# EAGLE schematic SparkFun_GPS_ZED-F9K (EAGLE 9.5.2)
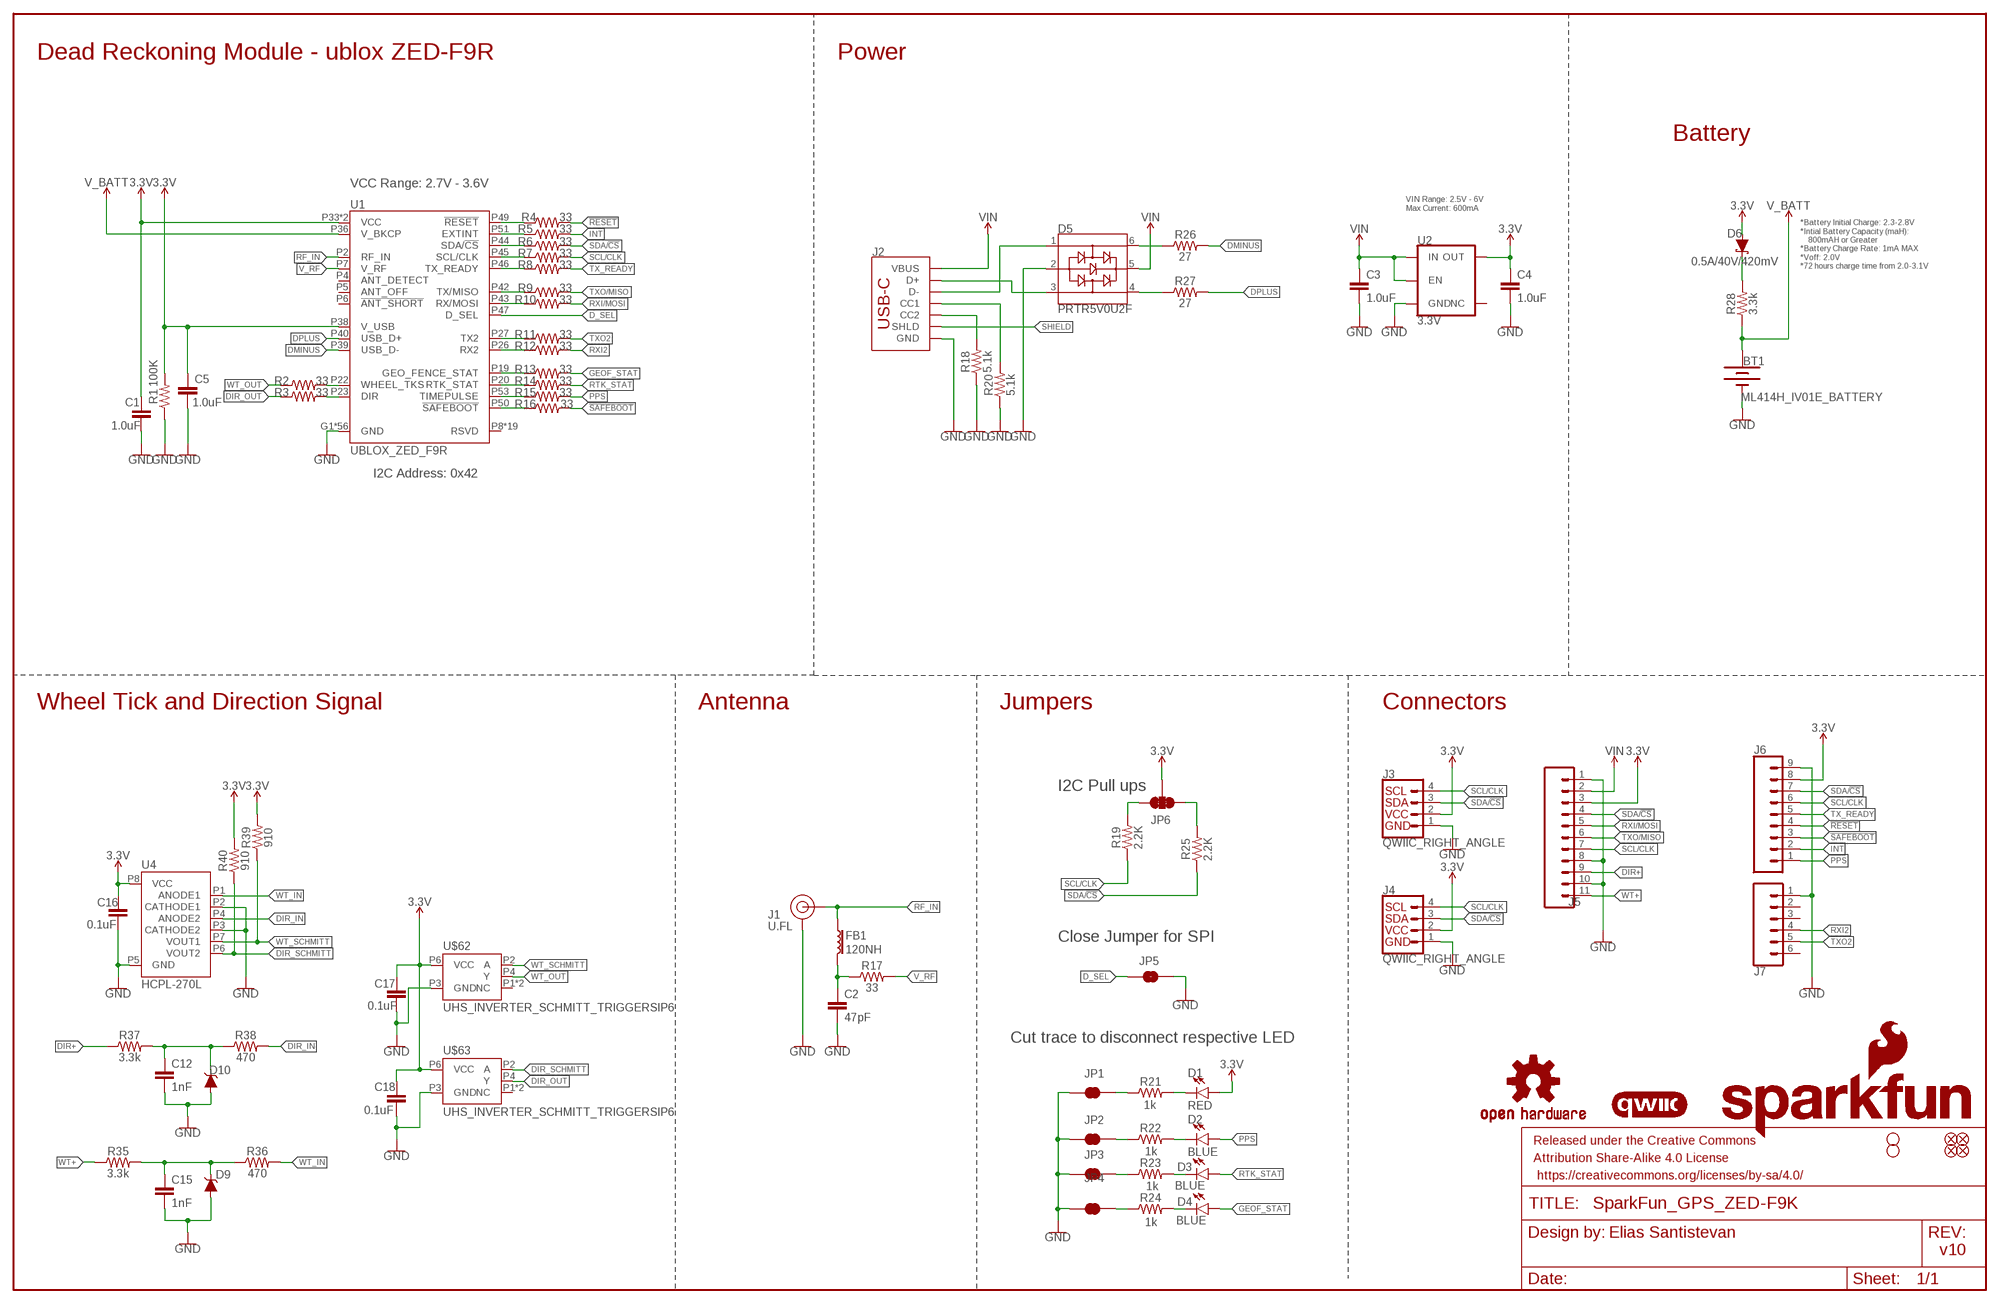
[diagram p0: schematic, sheet 1]

## Parts
$1_36_$_2020-02-13_17-32-45  STAND-OFFTIGHT  [STAND-OFF-TIGHT]
BT1  ML414H_IV01E_BATTERY  [ML414H_IV01E]
C1  1.0uF  1.0UF-0603-16V-10%-X7R  [0603]
C2  47pF  47PF-0402-25V-5%-X7R  [0402]
C3  1.0uF  1.0UF-0603-16V-10%-X7R  [0603]
C4  1.0uF  1.0UF-0603-16V-10%-X7R  [0603]
C5  1.0uF  1.0UF-0603-16V-10%-X7R  [0603]
C12  1nF  1.0NF/1000PF-0402-25V-10%-X7R  [0402]
C15  1nF  1.0NF/1000PF-0402-25V-10%-X7R  [0402]
C16  0.1uF  0.1UF-0402-6.3V-10%-X7R  [0402]
C17  0.1uF  0.1UF-0402-6.3V-10%-X7R  [0402]
C18  0.1uF  0.1UF-0402-6.3V-10%-X7R  [0402]
D1  RED  LED-RED0603  [LED-0603]
D2  BLUE  LED-BLUE0603  [LED-0603]
D3  BLUE  LED-BLUE0603  [LED-0603]
D4  BLUE  LED-BLUE0603  [LED-0603]
D5  PRTR5V0U2F  [SOT886]
D6  0.5A/40V/420mV  DIODE-SCHOTTKY-PMEG4005EJ  [SOD-323]
D9  0.5A/40V/420mV  BZX84_DIODE  [SOT23_BZX]
D10  0.5A/40V/420mV  BZX84_DIODE  [SOT23_BZX]
FB1  120NH  FERRITE_BEAD_GNSS  [0402_MURATA]
FD1  FIDUCIALUFIDUCIAL  [FIDUCIAL-MICRO]
FD2  FIDUCIALUFIDUCIAL  [FIDUCIAL-MICRO]
FD3  FIDUCIALUFIDUCIAL  [FIDUCIAL-MICRO]
FD4  FIDUCIALUFIDUCIAL  [FIDUCIAL-MICRO]
FRAME1  FRAME-LEDGER  [CREATIVE_COMMONS]
H2  STAND-OFFTIGHT  [STAND-OFF-TIGHT]
J1  U.FL  U.FL2PIN  [U.FL]
J2  USB_C_2-LAYER_PADS  [USB-C-16P-2LAYER-PADS]
J3  QWIIC_RIGHT_ANGLE  QWIIC_CONNECTORJS-1MM  [JST04_1MM_RA]
J4  QWIIC_RIGHT_ANGLE  QWIIC_CONNECTORJS-1MM  [JST04_1MM_RA]
J5  CONN_111X11_NO_SILK  [1X11_NO_SILK]
J6  CONN_09NO_SILK  [1X09_NO_SILK]
J7  CONN_06NO_SILK_NO_POP  [1X06_NO_SILK]
JP1  JUMPER-SMT_2_NC_TRACE_SILK  [SMT-JUMPER_2_NC_TRACE_SILK]
JP2  JUMPER-SMT_2_NC_TRACE_SILK  [SMT-JUMPER_2_NC_TRACE_SILK]
JP3  JUMPER-SMT_2_NC_TRACE_SILK  [SMT-JUMPER_2_NC_TRACE_SILK]
JP4  JUMPER-SMT_2_NC_TRACE_SILK  [SMT-JUMPER_2_NC_TRACE_SILK]
JP5  JUMPER-SMT_2_NO_SILK  [SMT-JUMPER_2_NO_SILK]
JP6  JUMPER-SMT_3_2-NC_TRACE_SILK  [SMT-JUMPER_3_2-NC_TRACE_SILK]
LOGO1  OSHW-LOGOM  [OSHW-LOGO-M]
LOGO2  QWIIC_LOGO_4MM  [QWIIC_4MM]
LOGO3  SFE_LOGO_NAME_FLAME.2_INCH  [SFE_LOGO_NAME_FLAME_.2]
R1  100K  100KOHM-0402-1/16W-1%  [0402]
R2  33  33OHM-0402-1/10W-1%  [0402]
R3  33  33OHM-0402-1/10W-1%  [0402]
R4  33  33OHM-0402-1/10W-1%  [0402]
R5  33  33OHM-0402-1/10W-1%  [0402]
R6  33  33OHM-0402-1/10W-1%  [0402]
R7  33  33OHM-0402-1/10W-1%  [0402]
R8  33  33OHM-0402-1/10W-1%  [0402]
R9  33  33OHM-0402-1/10W-1%  [0402]
R10  33  33OHM-0402-1/10W-1%  [0402]
R11  33  33OHM-0402-1/10W-1%  [0402]
R12  33  33OHM-0402-1/10W-1%  [0402]
R13  33  33OHM-0402-1/10W-1%  [0402]
R14  33  33OHM-0402-1/10W-1%  [0402]
R15  33  33OHM-0402-1/10W-1%  [0402]
R16  33  33OHM-0402-1/10W-1%  [0402]
R17  33  33OHM-0603-1/10W-1%  [0603]
R18  5.1k  5.1KOHM-0402-1/16W-1%  [0402]
R19  2.2K  2.2KOHM-0402-1/16W-1%  [0402]
R20  5.1k  5.1KOHM-0402-1/16W-1%  [0402]
R21  1KOHM-0402-1/16W-1%  [0402]
R22  1KOHM-0402-1/16W-1%  [0402]
R23  1KOHM-0402-1/16W-1%  [0402]
R24  1KOHM-0402-1/16W-1%  [0402]
R25  2.2K  2.2KOHM-0402-1/16W-1%  [0402]
R26  27  27OHM-0603-1/10W-1%  [0603]
R27  27  27OHM-0603-1/10W-1%  [0603]
R28  3.3k  3.3KOHM-0603-1/10W-1%  [0603]
R35  3.3k  3.3KOHM-0603-1/10W-1%  [0603]
R36  470  470OHM-0603-1/10W-1%  [0603]
R37  3.3k  3.3KOHM-0603-1/10W-1%  [0603]
R38  470  470OHM-0603-1/10W-1%  [0603]
R39  910  910OHM-0603-1/10W-5%  [0603]
R40  910  910OHM-0603-1/10W-5%  [0603]
U1  UBLOX_ZED_F9R  [UBLOX_ZED_F9R]
U2  3.3V  V_REG_AP2112K-3.3V  [SOT23-5]
U4  HCPL-270L  [SOP_8-PIN]
U$62  UHS_INVERTER_SCHMITT_TRIGGERSIP6  [SIP6]
U$63  UHS_INVERTER_SCHMITT_TRIGGERSIP6  [SIP6]

## Nets
3.3V: C1.1 C4.1 C5.1 C16.1 C17.1 C18.1 D1.A D6.A J3.2 J4.2 J5.3 J6.8 JP6.2 R1.2 R39.2 R40.2 U1.P33(VCC) U1.P34(VCC) U1.P38(V_USB) U2.5(OUT) U4.P8(VCC) U$62.P6(VCC) U$63.P6(VCC)
!RESET: J6.4 R4.2
!SAFEBOOT: J6.3 R16.2
D_SEL: JP5.1 U1.P47(D_SEL)
DIR+: J5.9 R37.1
DIR_IN: R38.2 U4.P4(ANODE2)
DIR_OUT: R3.1 U$63.P4(Y)
DIR_SCHMITT: R40.1 U4.P6(VOUT2) U$63.P2(A)
DMINUS: R26.2 U1.P39(USB_D-)
DPLUS: R27.2 U1.P40(USB_D+)
GEOF_STAT: D4.A R13.2
GND: BT1.- C1.2 C2.2 C3.2 C4.2 C5.2 C12.2 C15.2 C16.2 C17.2 C18.2 D5.2 D9.P1(A) D10.P1(A) J1.1(GND) J1.2(GND) J2.GND J2.GND2(GND) J3.1 J4.1 J5.1 J5.8 J5.10 J6.9 J7.1 JP1.1 JP2.1 JP3.1 JP4.1 JP5.2 R1.1 R18.1 R20.1 U1.G1(GND) U1.G2(GND) U1.G3(GND) U1.G4(GND) U1.G5(GND) U1.G6(GND) U1.G7(GND) U1.G8(GND) U1.G9(GND) U1.G10(GND) U1.G11(GND) U1.G12(GND) U1.G13(GND) U1.G14(GND) U1.G15(GND) U1.G16(GND) U1.G17(GND) U1.G18(GND) U1.G19(GND) U1.G20(GND) U1.G21(GND) U1.G22(GND) U1.G23(GND) U1.G24(GND) U1.G25(GND) U1.G26(GND) U1.G27(GND) U1.G28(GND) U1.G29(GND) U1.G30(GND) U1.G31(GND) U1.G32(GND) U1.G33(GND) U1.G34(GND) U1.G35(GND) U1.G36(GND) U1.G37(GND) U1.G38(GND) U1.G39(GND) U1.G40(GND) U1.G41(GND) U1.G42(GND) U1.G43(GND) U1.G44(GND) U1.G45(GND) U1.G46(GND) U1.G47(GND) U1.G48(GND) U1.P1(GND) U1.P3(GND) U1.P12(GND) U1.P14(GND) U1.P32(GND) U1.P37(GND) U1.P41(GND) U1.P48(GND) U2.2(GND) U4.P2(CATHODE1) U4.P3(CATHODE2) U4.P5(GND) U$62.P3(GND) U$63.P3(GND)
INT: J6.2 R5.2
N$1: JP6.1 R25.2
N$2: D6.C R28.2
N$3: JP6.3 R19.2
N$4: D1.C R21.2
N$5: C2.1 FB1.P2 R17.1
N$6: D5.3 J2.A6(D+) J2.B6(D+)
N$7: D5.1 J2.A7(D-) J2.B7(D-)
N$8: JP1.2 R21.1
N$9: D5.6 R26.1
N$10: D5.4 R27.1
N$11: R4.1 U1.P49(!RESET!)
N$12: R5.1 U1.P51(EXTINT)
N$14: J2.B5(CC2) R18.2
N$15: J2.A5(CC1) R20.2
N$16: R6.1 U1.P44(SDA/!CS!)
N$17: R7.1 U1.P45(SCL/CLK)
N$18: R8.1 U1.P46(TX_READY)
N$19: R9.1 U1.P42(TX/MISO)
N$20: R10.1 U1.P43(RX/MOSI)
N$21: R11.1 U1.P27(TX2)
N$22: JP3.2 R23.1
N$23: JP2.2 R22.1
N$24: D2.C R22.2
N$25: D3.C R23.2
N$26: R12.1 U1.P26(RX2)
N$27: R13.1 U1.P19(GEO_FENCE_STAT)
N$28: R14.1 U1.P20(RTK_STAT)
N$29: R15.1 U1.P53(TIMEPULSE)
N$30: R16.1 U1.P50(!SAFEBOOT!)
N$31: R2.2 U1.P22(WHEEL_TKS)
N$32: R3.2 U1.P23(DIR)
N$33: JP4.2 R24.1
N$34: D4.C R24.2
N$35: C15.1 D9.P3(C) R35.2 R36.1
N$37: C12.1 D10.P3(C) R37.2 R38.1
PPS: D2.A J6.1 R15.2
RF_IN [Antenna]: FB1.P1 J1.FEED(SIGNAL) U1.P2(RF_IN)
RTK_STAT: D3.A R14.2
RXI2: J7.4 R12.2
RXI/MOSI: J5.5 R10.2
SCL/CLK: J3.4 J4.4 J5.7 J6.6 R7.2 R19.1
SDA/!CS: J3.3 J4.3 J5.4 J6.7 R6.2 R25.1
SHIELD: J2.SHLD1(SHLD) J2.SHLD2(SHLD) J2.SHLD3(SHLD) J2.SHLD4(SHLD)
TX_READY: J6.5 R8.2
TXO2: J7.5 R11.2
TXO/MISO: J5.6 R9.2
V_BATT: BT1.+ R28.1 U1.P36(V_BKCP)
V_RF: R17.2 U1.P7(V_RF)
VIN: C3.1 D5.5 J2.VBUS1(VBUS) J2.VBUS2(VBUS) J5.2 U2.1(IN) U2.3(EN)
WT+: J5.11 R35.1
WT_IN: R36.2 U4.P1(ANODE1)
WT_OUT: R2.1 U$62.P4(Y)
WT_SCHMITT: R39.1 U4.P7(VOUT1) U$62.P2(A)
Unconnected: J7.2 J7.3 J7.6 U1.P4(ANT_DETECT) U1.P5(ANT_OFF) U1.P6(!ANT_SHORT!) U1.P8(RSVD) U1.P9(RSVD) U1.P10(RSVD) U1.P11(RSVD) U1.P13(RSVD) U1.P15(RSVD) U1.P16(RSVD) U1.P17(RSVD) U1.P18(RSVD) U1.P21(RSVD) U1.P24(RSVD) U1.P25(RSVD) U1.P28(RSVD) U1.P29(RSVD) U1.P30(RSVD) U1.P31(RSVD) U1.P35(RSVD) U1.P52(RSVD) U1.P54(RSVD) U2.4(NC) U$62.P1(NC) U$62.P5(NC) U$63.P1(NC) U$63.P5(NC)

## Notes on the sheet
- Dead Reckoning Module - ublox ZED-F9R | Power
- Battery
- VCC Range: 2.7V - 3.6V
- VIN Range: 2.5V - 6V
  Max Current: 600mA
- *Battery Initial Charge: 2.3-2.8V
  *Intial Battery Capacity (maH): 
      800mAH or Greater
  *Battery Charge Rate: 1mA MAX
  *Voff: 2.0V
  *72 hours charge time from 2.0-3.1V
- I2C Address: 0x42
- Wheel Tick and Direction Signal | Antenna | Jumpers | Connectors
- I2C Pull ups
- Close Jumper for SPI
- Cut trace to disconnect respective LED
- 1k
- 1k
- 1k
- 1k
- Elias Santistevan
- v10

## Library data of the parts
$1_36_$_2020-02-13_17-32-45 H2 = SparkFun-Hardware:STAND-OFF: Stand Off Drill holes for mechanically mounting via screws, standoffs, etc. Note: Use the keepout ring to avoid running the screw head into surrounding components. Variant Overviews STAND-OFF - Mechanical footprint for a #4 phillips button head screw. STAND-OFF-TIGHT - Mechanical footprint for a #4 phillips button head screw, Example SparkFun Products Screw - Phillips Head (1/4", 4-40, 10 pack) <https://www.sparkfun.com/products/10453> (PRT-10453) Screw - Phillips Head (1/2", 4-40, 10 pack) <https://www.sparkfun.com/products/10452> (PRT-10452) Screw - Phillips Head (3/4", 4-40, 10 pack) <https://www.sparkfun.com/products/10451> (PRT-10451) Screw - Phillips Head (1", 4-40, 10 pack) <https://www.sparkfun.com/products/10450> (PRT-10450)
BT1 = SparkFun-Batteries:ML414H_IV01E_BATTERY: SEIKO ML414H-IV01E Reflowable Lithium Battery ML414H is a rechargeable, coin type battery with features such as Pb-free reflowable (Peak temperature: 260 C) and high temperature heat resistance. Battery Characteristics: 3.1V max voltage Voff is 2V 1mAH 3k series resistor with battery 72 hour charge time from 2.0-3.1V 2.3-2.8V initial charge; PROD_ID: BATT-14267
C1 C3-C5 = SparkFun-Capacitors:1.0UF: 1µF ceramic capacitors A capacitor is a passive two-terminal electrical component used to store electrical energy temporarily in an electric field.; PROD_ID: CAP-13930
C2 = SparkFun-Capacitors:47PF: 47pF ceramic capacitors A capacitor is a passive two-terminal electrical component used to store electrical energy temporarily in an electric field.; PROD_ID: CAP-15063
C12 C15 = SparkFun-Capacitors:1.0NF/1000PF: 1nF/1,000pF ceramic capacitors A capacitor is a passive two-terminal electrical component used to store electrical energy temporarily in an electric field.; PROD_ID: CAP-15061
C16-C18 = SparkFun-Capacitors:0.1UF: 0.1µF ceramic capacitors A capacitor is a passive two-terminal electrical component used to store electrical energy temporarily in an electric field.; PROD_ID: CAP-14993
D1 = SparkFun-LED:LED-RED: Red SMD LED Used in manufacturing of most products at SparkFun Packages: 0603 - SMD 0603 package [Product Link] <http://docs.avagotech.com/docs/AV02-0551EN> 0603 SMART - SMD 0603 SMART package ( more efficient and expensive)[Product Link] <http://www.osram-os.com/Graphics/XPic2/00077099_0.pdf> 1206 - SMD1206 package [Product Link] <https://www.sparkfun.com/datasheets/DevTools/LilyPad/Q150OVS4.pdff> SparkFun Products: Pro Mini 328 -5V <https://www.sparkfun.com/products/821> RedBoard <https://www.sparkfun.com/products/12757> IOIO-OTG <https://www.sparkfun.com/products/13613>; PROD_ID: DIO-00819
D2-D4 = SparkFun-LED:LED-BLUE: Blue SMD LED Used in manufacturing of various products at SparkFun Packages: 0603 - SMD 0603 package [Product Link] <http://www.digikey.com/product-detail/en/SMLE12BC7TT86/511-1589-2-ND/1641808> 1206 - SMD1206 package [Product Link] <http://www.digikey.com/product-detail/en/lite-on-inc/LTST-C150TBKT/160-1643-1-ND/573584> SparkFun Products: ESP8266 Thing-Dev Board <https://www.sparkfun.com/products/13711> RedBoard <https://www.sparkfun.com/products/12757>; PROD_ID: DIO-08575
D5 = SparkFun-IC-Power:PRTR5V0U2: A small ESD protection device. Most commonly used on USB D+/D- signals to protect large, expensive, or especially sensitive USB enabled devices.; PROD_ID: DIO-14084
D6 = SparkFun-DiscreteSemi:DIODE-SCHOTTKY: Schottky diode A Schottky diode is a semiconductor diode which has a low forward voltage drop and a very fast switching action.; PROD_ID: DIO-10955
D9 D10 = classified:BZX84_DIODE
FB1 = SparkFun-Coils:FERRITE_BEAD_GNSS
FD1-FD4 = SparkFun-Aesthetics:FIDUCIAL: Fiducial Alignment Points Point-of-reference for pick-and-place machines and other optical instruments.
FRAME1 = SparkFun-Aesthetics:FRAME-LEDGER: Schematic Frame - Ledger Standard 11x14 US Ledger frame
J1 = SparkFun-Connectors:U.FL2PIN: SMD Antenna Connector - U.FL 2mm height, 3.0mm x 3.0mm receptacle size. SparkFun Products: SparkFun WiFi Shield - ESP8266 <https://www.sparkfun.com/products/13287> SparkFun ESP8266 Thing <https://www.sparkfun.com/products/13231> SparkFun MiniGen - Pro Mini Signal Generator Shield <https://www.sparkfun.com/products/11420>; PROD_ID: CONN-09193; SF_ID: WRL-09144
J2 = SparkFun-Connectors:USB_C: USB Type C 16Pin Connector Super Speed pins not available on the 16-pin purely SMD connector so this part is best for USB 2.0 implementations. D1 and D2 are tied together enabling D+/- no matter which way the cable is plugged into the connector. The two channel configuration pins (CC1/2) are exposed. These are normally connected to ground via 5.1k resistors but can be reconfigured for high current/high power applications.; PROD_ID: CONN-14122
J3 J4 = SparkFun-Connectors:QWIIC_CONNECTOR: SparkFun I2C Standard Qwiic Connector An SMD 1mm pitch JST connector makes it easy and quick (get it? Qwiic?) to connect I2C devices to each other. The Qwiic system <http://www.sparkfun.com/qwiic> enables fast and solderless connection between popular platforms and various sensors and actuators. We carry 200mm <https://www.sparkfun.com/products/14204>, 100mm <https://www.sparkfun.com/products/14205>, 50mm <https://www.sparkfun.com/products/14206>, and breadboard friendly <https://www.sparkfun.com/products/14207> Qwiic cables. We also offer 10 pcs strips <https://www.sparkfun.com/products/14323> the SMD connectors.; PROD_ID: CONN-13694
J5 = SparkFun-Connectors:CONN_11: Multi connection point. Often used as Generic Header-pin footprint for 0.1 inch spaced/style header connections On any of the 0.1 inch spaced packages, you can populate with these: Break Away Headers - Straight <https://www.sparkfun.com/products/116> (PRT-00116) Break Away Male Headers - Right Angle <https://www.sparkfun.com/products/553> (PRT-00553) Female Headers <https://www.sparkfun.com/products/115> (PRT-00115) Break Away Headers - Machine Pin <https://www.sparkfun.com/products/117> (PRT-00117) Break Away Female Headers - Swiss Machine Pin <https://www.sparkfun.com/products/743> (PRT-00743) For SCREWTERMINALS and SPRING TERMINALS visit here: Screw Terimnals on SparkFun.com <https://www.sparkfun.com/search/results?term=Screw+Terminals> (5mm/3.5mm/2.54mm spacing) This device is also useful as a general connection point to wire up your design to another part of your project. Our various solder wires solder well into these plated through hole pads. Hook-Up Wire - Assortment (Stranded, 22 AWG) <https://www.sparkfun.com/products/11375> (PRT-11375) Hook-Up Wire - Assortment (Solid Core, 22 AWG) <https://www.sparkfun.com/products/11367> (PRT-11367) View the entire wire category on our website here <https://www.sparkfun.com/categories/141>
J6 = SparkFun-Connectors:CONN_09: Multi connection point. Often used as Generic Header-pin footprint for 0.1 inch spaced/style header connections On any of the 0.1 inch spaced packages, you can populate with these: Break Away Headers - Straight <https://www.sparkfun.com/products/116> (PRT-00116) Break Away Male Headers - Right Angle <https://www.sparkfun.com/products/553> (PRT-00553) Female Headers <https://www.sparkfun.com/products/115> (PRT-00115) Break Away Headers - Machine Pin <https://www.sparkfun.com/products/117> (PRT-00117) Break Away Female Headers - Swiss Machine Pin <https://www.sparkfun.com/products/743> (PRT-00743) For SCREWTERMINALS and SPRING TERMINALS visit here: Screw Terimnals on SparkFun.com <https://www.sparkfun.com/search/results?term=Screw+Terminals> (5mm/3.5mm/2.54mm spacing) This device is also useful as a general connection point to wire up your design to another part of your project. Our various solder wires solder well into these plated through hole pads. Hook-Up Wire - Assortment (Stranded, 22 AWG) <https://www.sparkfun.com/products/11375> (PRT-11375) Hook-Up Wire - Assortment (Solid Core, 22 AWG) <https://www.sparkfun.com/products/11367> (PRT-11367) View the entire wire category on our website here <https://www.sparkfun.com/categories/141> Special notes: Molex polarized connector foot print use with SKU : PRT-08231 with associated crimp pins and housings. 1MM SMD Version SKU: PRT-10208 NOTES ON THE VARIANTS LOCK and LOCK_LONGPADS... This footprint was designed to help hold the alignment of a through-hole component (i.e. 6-pin header) while soldering it into place. You may notice that each hole has been shifted either up or down by 0.005 of an inch from it's more standard position (which is a perfectly straight line). This slight alteration caused the pins (the squares in the middle) to touch the edges of the holes. Because they are alternating, it causes a "brace" to hold the component in place. 0.005 has proven to be the perfect amount of "off-center" position when using our standard breakaway headers. Although looks a little odd when you look at the bare footprint, once you have a header in there, the alteration is very hard to notice. Also,if you push a header all the way into place, it is covered up entirely on the bottom side.
J7 = SparkFun-Connectors:CONN_06: Multi connection point. Often used as Generic Header-pin footprint for 0.1 inch spaced/style header connections On any of the 0.1 inch spaced packages, you can populate with these: Break Away Headers - Straight <https://www.sparkfun.com/products/116> (PRT-00116) Break Away Male Headers - Right Angle <https://www.sparkfun.com/products/553> (PRT-00553) Female Headers <https://www.sparkfun.com/products/115> (PRT-00115) Break Away Headers - Machine Pin <https://www.sparkfun.com/products/117> (PRT-00117) Break Away Female Headers - Swiss Machine Pin <https://www.sparkfun.com/products/743> (PRT-00743) Arduino Stackable Header - 6 Pin <https://www.sparkfun.com/products/9280> (PRT-09280) For SCREWTERMINALS and SPRING TERMINALS visit here: Screw Terimnals on SparkFun.com <https://www.sparkfun.com/search/results?term=Screw+Terminals> (5mm/3.5mm/2.54mm spacing) This device is also useful as a general connection point to wire up your design to another part of your project. Our various solder wires solder well into these plated through hole pads. Hook-Up Wire - Assortment (Stranded, 22 AWG) <https://www.sparkfun.com/products/11375> (PRT-11375) Hook-Up Wire - Assortment (Solid Core, 22 AWG) <https://www.sparkfun.com/products/11367> (PRT-11367) View the entire wire category on our website here <https://www.sparkfun.com/categories/141>
JP1-JP4 = SparkFun-Jumpers:JUMPER-SMT_2_NC_TRACE: Normally closed trace jumper This jumper has a trace between two pads so it's normally closed (NC). Use a razor knife to open the connection. For best results follow the IPC guidelines for cutting traces: Cutout at least 0.063 mm (0.005 in). Remove all loose material to clean up the cut area. Seal the cut with an approved epoxy. Reapply solder to reclose the connection.
JP5 = SparkFun-Jumpers:JUMPER-SMT_2_NO: Normally open jumper This jumper has two pads in close proximity to each other. Apply solder to close the connection. Round pads are easier to solder for beginners, but are a lot larger. SparkFun Product that uses the round pads: SparkFun EL Sequencer <https://www.sparkfun.com/products/12781>
JP6 = SparkFun-Jumpers:JUMPER-SMT_3_2-NC_TRACE: Normally closed trace jumper (2 of 2 connections) This jumper has a trace between all three pads so they are normally closed (NC). Use a razor knife to open the connection(s). For best results follow the IPC guidelines for cutting traces: Cutout at least 0.063 mm (0.005 in). Remove all loose material to clean up the cut area. Seal the cut with an approved epoxy. Reapply solder to reclose the connection(s).
LOGO1 = SparkFun-Aesthetics:OSHW-LOGO: Open-Source Hardware (OSHW) Logo This logo indicates the piece of hardware it is found on incorporates a OSHW license and/or adheres to the definition of open source hardware found here: http://freedomdefined.org/OSHW
LOGO2 = SparkFun-Aesthetics:QWIIC_LOGO: Qwiic Logos for placement on schematic and PCB. The 5.5mm silk logo is best for placing next to Qwiic connector.
LOGO3 = SparkFun-Aesthetics:SFE_LOGO_NAME_FLAME: SparkFun Font Logo w/ Flame This is the SparkFun full logo. The logo on the schematic will always be the same size; the package variant is the height of the flame part of the logo. Default layer for the logo on the board is tSilk.
R1 = SparkFun-Resistors:100KOHM: 100kΩ resistor A resistor is a passive two-terminal electrical component that implements electrical resistance as a circuit element. Resistors act to reduce current flow, and, at the same time, act to lower voltage levels within circuits. - Wikipedia; PROD_ID: RES-13495
R2-R16 = SparkFun-Resistors:33OHM: 33Ω resistor A resistor is a passive two-terminal electrical component that implements electrical resistance as a circuit element. Resistors act to reduce current flow, and, at the same time, act to lower voltage levels within circuits. - Wikipedia; PROD_ID: RES-14883
R17 = SparkFun-Resistors:33OHM: 33Ω resistor A resistor is a passive two-terminal electrical component that implements electrical resistance as a circuit element. Resistors act to reduce current flow, and, at the same time, act to lower voltage levels within circuits. - Wikipedia; PROD_ID: RES-08270
R18 R20 = SparkFun-Resistors:5.1KOHM; PROD_ID: RES-14340
R19 R25 = SparkFun-Resistors:2.2KOHM: 2.2kΩ resistor A resistor is a passive two-terminal electrical component that implements electrical resistance as a circuit element. Resistors act to reduce current flow, and, at the same time, act to lower voltage levels within circuits. - Wikipedia; PROD_ID: RES-14341
R21-R24 = SparkFun-Resistors:1KOHM: 1kΩ resistor A resistor is a passive two-terminal electrical component that implements electrical resistance as a circuit element. Resistors act to reduce current flow, and, at the same time, act to lower voltage levels within circuits. - Wikipedia; PROD_ID: RES-14342
R26 R27 = SparkFun-Resistors:27OHM: 27Ω resistor A resistor is a passive two-terminal electrical component that implements electrical resistance as a circuit element. Resistors act to reduce current flow, and, at the same time, act to lower voltage levels within circuits. - Wikipedia; PROD_ID: RES-09334
R28 R35 R37 = SparkFun-Resistors:3.3KOHM: 3.3kΩ resistor A resistor is a passive two-terminal electrical component that implements electrical resistance as a circuit element. Resistors act to reduce current flow, and, at the same time, act to lower voltage levels within circuits. - Wikipedia; PROD_ID: RES-07851
R36 R38 = SparkFun-Resistors:470OHM: 470Ω resistor A resistor is a passive two-terminal electrical component that implements electrical resistance as a circuit element. Resistors act to reduce current flow, and, at the same time, act to lower voltage levels within circuits. - Wikipedia; PROD_ID: RES-07869
R39 R40 = classified:910OHM-0603-1/10W-5%: 910 Ohm Resistor Digikey Link <https://www.digikey.com/product-detail/en/yageo/RC0603JR-07910RL/311-910GRTR-ND/726838>
U1 = classified:UBLOX_ZED_F9R: u-blox ZED-F9K ADR GPS Unit with Real Time Kinematics (RTK) and internal IMU = Automotive Dead Reckoning; PROD_ID: IC-14716
U2 = SparkFun-IC-Power:V_REG_AP2112: AP2112 - 600mA CMOS LDO Regulator w/ Enable The AP2112 is CMOS process low dropout linear regulator with enable function, the regulator delivers a guaranteed 600mA (min.) continuous load current. Features Output Voltage Accuracy: ±1.5% Output Current: 600mA (Min.) Foldback Short Current Protection: 50mA Enable Function to Turn ON/OFF VOUT Low Dropout Voltage (3.3V): 250mV (Typ.) @IOUT=600mA Excellent Load Regulation: 0.2%/A (Typ.) Excellent Line Regulation: 0.02%/V (Typ.) Low Quiescent Current: 55μA (Typ.) Low Standby Current: 0.01μA (Typ.) Low Output Noise: 50μVRMS PSRR: 100Hz -65dB, 1kHz -65dB OTSD Protection Stable with 1.0μF Flexible Cap: Ceramic, Tantalum and Aluminum Electrolytic Operation Temperature Range: -40°C to 85°C ESD: MM 400V, HBM 4000V; PROD_ID: VREG-12457
U4 = classified:HCPL-270L: HCPL-270L These high gain series couplers use a Light Emitting Diode and an integrated high gain photodetector to provide extremely high current transfer ratio between input and output. Separate pins for the photodiode and output stage result in LVTTL compatible saturation voltages and high speed operation. Where desired, the VCC and VO terminals may be tied together to achieve conventional photo-darlington operation. A base access terminal allows a gain bandwidth adjustment to be made. These optocouplers are for use in LVTTL/LVCMOS or other low power applications. A 400% minimum current transfer ratio is guaranteed over 0 to +70˚C operating range for only 0.5 mA of LED current. Digikey Link <https://www.digikey.com/products/en?mpart=HCPL-070L-500E&v=516>
U$62 U$63 = classified:UHS_INVERTER_SCHMITT_TRIGGER: NC7SZ14 The NC7SZ14 is a single inverter with Schmitt trigger input from ON Semiconductor’s Ultra−High Speed (UHS) series of TinyLogic. The device is fabricated w ith advanced CMOS technology to achieve ultra−high speed with high output drive while maintaining low static power dissipation over a very broad VCC operating range. The device is specified to operate over the 1.65 V to 5.5 V VCC range. The inputs and outputs are high−impedance when VCC is 0 V. Inputs tolerate voltages up to 5.5 V independent of VCC operating voltage. Digikey Link <https://www.digikey.com/product-detail/en/on-semiconductor/NC7SZ14M5X/NC7SZ14M5XDKR-ND/1628606>

## Net classes
1 Antenna: width 1 mm, clearance 0.3 mm